# Altium schematic sheet 9000H发射板.SchDoc
size A4
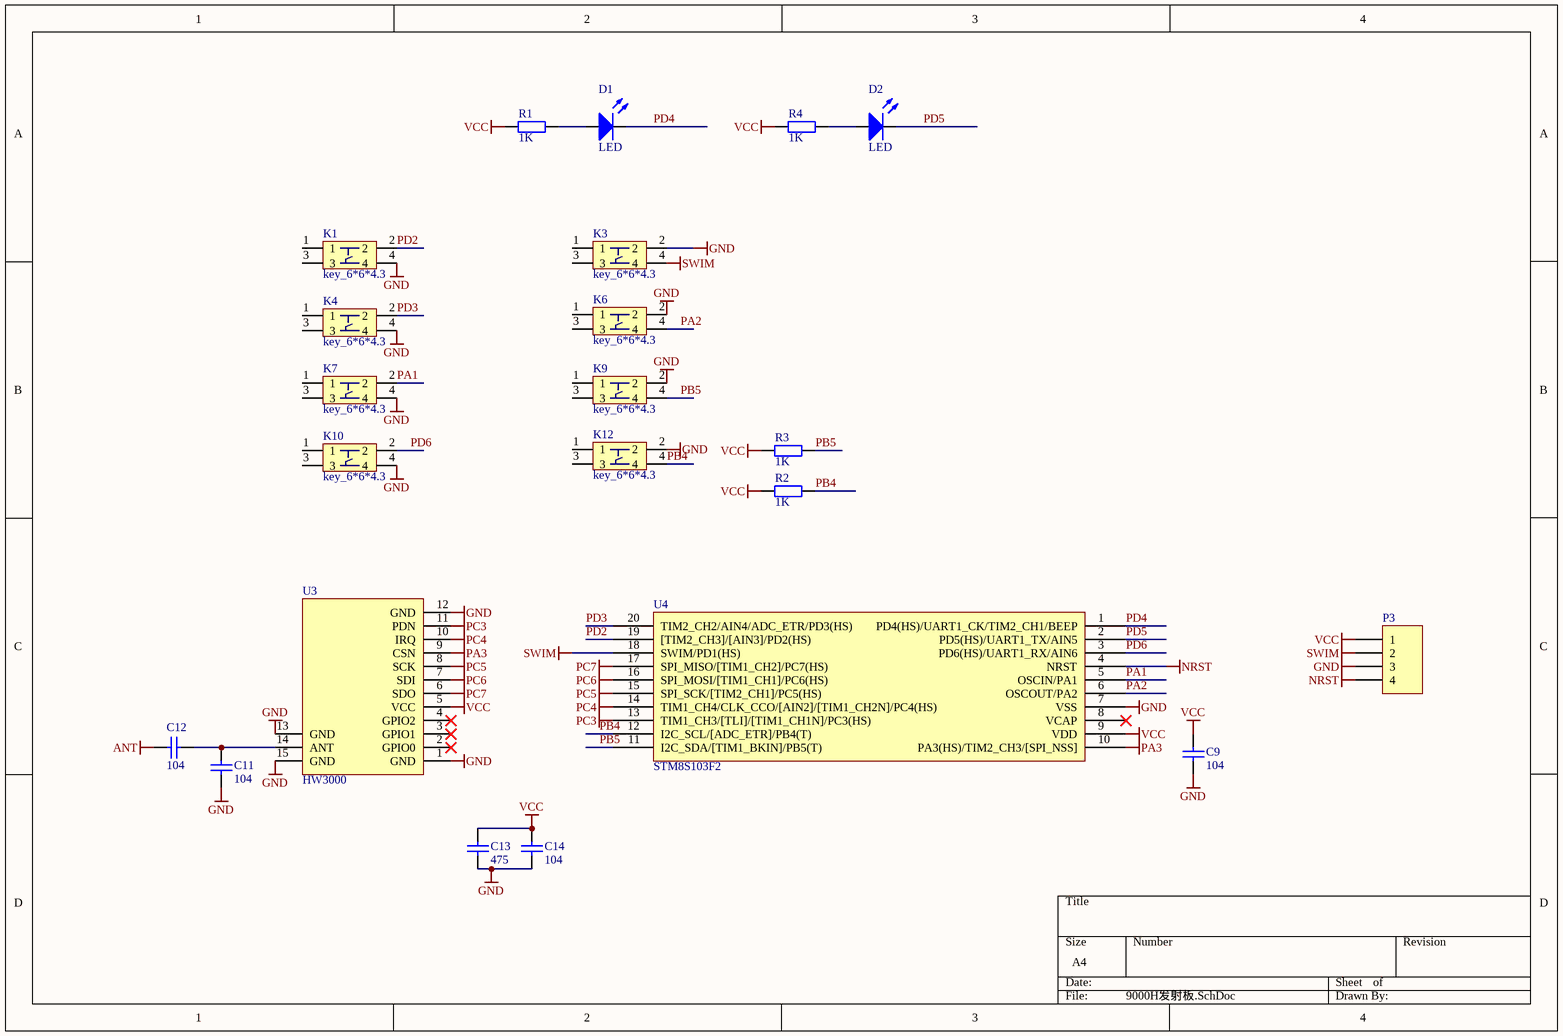
[diagram p0: 9000H发射板.SchDoc]

## Parts
C9  104  [0805C]
C11  104  [0805C]
C12  104  [0805C]
C13  475  [0805C]
C14  104  [0805C]
D1  LED  [0603C]
D2  LED  [0603C]
K1  key_6*6*4.3  [KEY_6*6*4.3]
K3  key_6*6*4.3  [KEY_6*6*4.3]
K4  key_6*6*4.3  [KEY_6*6*4.3]
K6  key_6*6*4.3  [KEY_6*6*4.3]
K7  key_6*6*4.3  [KEY_6*6*4.3]
K9  key_6*6*4.3  [KEY_6*6*4.3]
K10  key_6*6*4.3  [KEY_6*6*4.3]
K12  key_6*6*4.3  [KEY_6*6*4.3]
P3  Header 4  [HDR1X4_3D]  (value not drawn)
R1  1K  [0603R]
R2  1K  [0603R]
R3  1K  [0603R]
R4  1K  [0603R]
U3  HW3000  [HW3000]
U4  STM8S103F2  [SOP20(STM8S)]

## Nets
ANT: C12.2
GND: C9.1 C11.1 C13.2 C14.1 K1.4 K3.2 K4.4 K6.2 K7.4 K9.2 K10.4 K12.2 P3.3 U3.1(GND) U3.12(GND) U3.13(GND) U3.15(GND) U4.7(VSS)
NRST: P3.4 U4.4(NRST)
PA3: U3.9(CSN) U4.10(PA3(HS)/TIM2_CH3/[SPI_NSS])
PC3: U3.11(PDN) U4.13(TIM1_CH3/[TLI]/[TIM1_CH1N]/PC3(HS))
PC4: U3.10(IRQ) U4.14(TIM1_CH4/CLK_CCO/[AIN2]/[TIM1_CH2N]/PC4(HS))
PC5: U3.8(SCK) U4.15(SPI_SCK/[TIM2_CH1]/PC5(HS))
PC6: U3.7(SDI) U4.16(SPI_MOSI/[TIM1_CH1]/PC6(HS))
PC7: U3.6(SDO) U4.17(SPI_MISO/[TIM1_CH2]/PC7(HS))
SWIM: K3.4 P3.2 U4.18(SWIM/PD1(HS))
VCC: C9.2 C13.1 C14.2 P3.1 R1.1 R2.2 R3.2 R4.1 U3.5(VCC) U4.9(VDD)
PA1: K7.2 U4.5(OSCIN/PA1)
PA2: K6.4 U4.6(OSCOUT/PA2)
PB4: K12.4 R2.1 U4.12(I2C_SCL/[ADC_ETR]/PB4(T))
PB5: K9.4 R3.1 U4.11(I2C_SDA/[TIM1_BKIN]/PB5(T))
PD2: K1.2 U4.19([TIM2_CH3]/[AIN3]/PD2(HS))
PD3: K4.2 U4.20(TIM2_CH2/AIN4/ADC_ETR/PD3(HS))
PD4: D1.2(K) U4.1(PD4(HS)/UART1_CK/TIM2_CH1/BEEP)
PD5: D2.2(K) U4.2(PD5(HS)/UART1_TX/AIN5)
PD6: K10.2 U4.3(PD6(HS)/UART1_RX/AIN6)
NetC11_2: C11.2 C12.1 U3.14(ANT)
NetD1_1: D1.1(A) R1.2
NetD2_1: D2.1(A) R4.2

Not connected (* = marked no-connect by the designer): K1 1 3; K3 1 3; K4 1 3; K6 1 3; K7 1 3; K9 1 3; K10 1 3; K12 1 3; U3 2(GPIO0)* 3(GPIO1)* 4(GPIO2)*; U4 8(VCAP)*

## Library data of the parts
C9 C11-C14 = Cap: 无极性电容
D1 D2 = LED_: 发光二极管
P3 = Header 4: Header, 4-Pin; LatestRevisionDate: 17-Jul-2002; LatestRevisionNote: Re-released for DXP Platform.; Publisher: Altium Limited
R1-R4 = Res_: 电阻